# Altium project mchf_pro_mix.PrjPCB
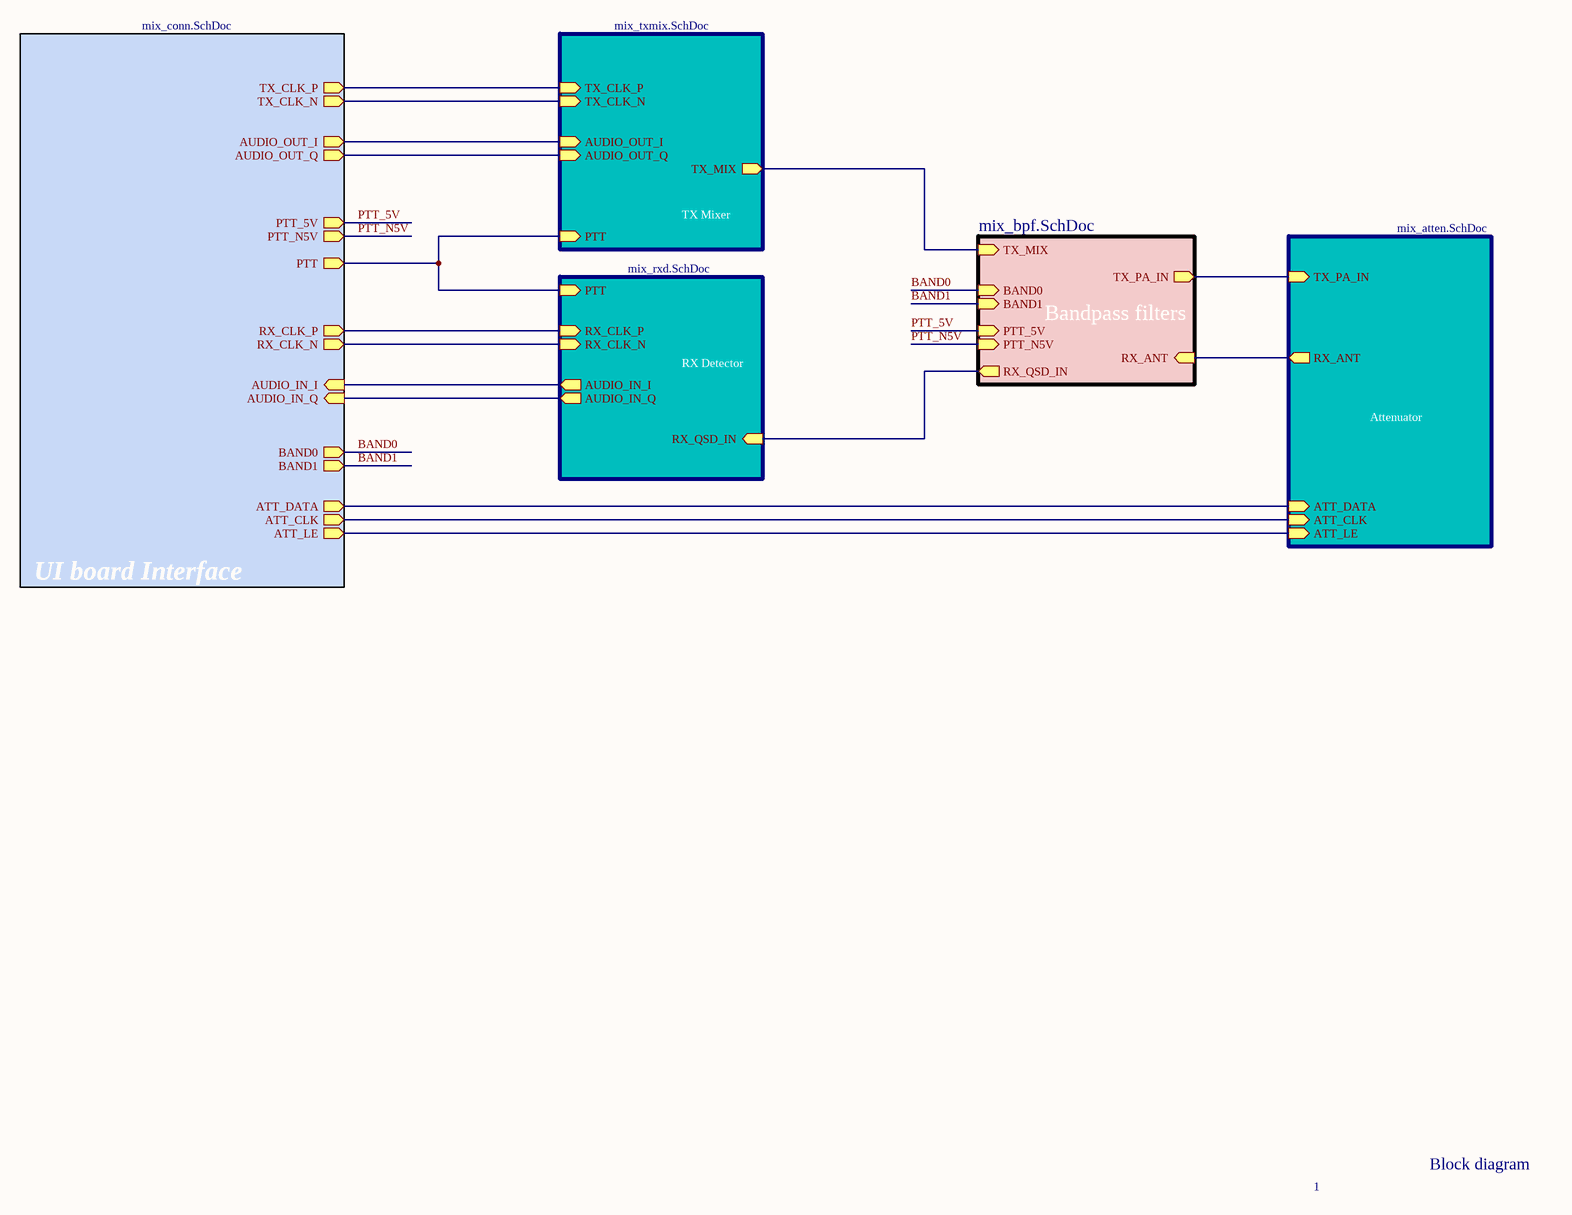
[diagram p0: mix_main.SchDoc]
5 sheets, 116 parts. Net scope: hierarchical (ports join the sheet entries above them; power ports are global).
Board file: mchf_pro_mix.PcbDoc
Sheets:
  mix_main.SchDoc
    UI board Interface = mix_conn.SchDoc
    TX Mixer = mix_txmix.SchDoc
    RX Detector = mix_rxd.SchDoc
    Attenuator = mix_atten.SchDoc

## Sheet mix_main.SchDoc: mcHF Pro Transceiver Mixer board
size A3; Author: Krassi Atanassov; CompanyName: MØNKA; Engineer: For radio amateurs experimentation, non-commercial use only. Thank you!; Revision: 0.8.6; SheetTotal: 6

### Sub-sheets
Attenuator = mix_atten.SchDoc: RX_ANT (out), ATT_DATA (in), ATT_CLK (in), ATT_LE (in), TX_PA_IN (in)
Bandpass filters = mix_bpf.SchDoc (file not in this document): BAND0 (in), BAND1 (in), PTT_5V (in), RX_ANT (in), TX_PA_IN (out), PTT_N5V (in), RX_QSD_IN (out), TX_MIX (in)
RX Detector = mix_rxd.SchDoc: RX_QSD_IN (in), AUDIO_IN_I (out), AUDIO_IN_Q (out), PTT (in), RX_CLK_N (in), RX_CLK_P (in)
TX Mixer = mix_txmix.SchDoc: TX_MIX (out), TX_CLK_P (in), TX_CLK_N (in), AUDIO_OUT_I (in), AUDIO_OUT_Q (in), PTT (in)
UI board Interface = mix_conn.SchDoc: AUDIO_OUT_Q (out), AUDIO_IN_I (in), AUDIO_OUT_I (out), AUDIO_IN_Q (in), RX_CLK_N (out), RX_CLK_P (out), TX_CLK_P (out), TX_CLK_N (out), PTT (out), ATT_DATA (out), ATT_CLK (out), ATT_LE (out), PTT_5V (out), PTT_N5V (out), BAND0 (out), BAND1 (out)

### Nets
ATT_CLK: sheet UI board Interface/ATT_CLK, sheet Attenuator/ATT_CLK
ATT_DATA: sheet UI board Interface/ATT_DATA, sheet Attenuator/ATT_DATA
ATT_LE: sheet UI board Interface/ATT_LE, sheet Attenuator/ATT_LE
BAND0: sheet UI board Interface/BAND0, sheet Bandpass filters/BAND0
BAND1: sheet UI board Interface/BAND1, sheet Bandpass filters/BAND1
PTT_3V: sheet UI board Interface/PTT, sheet TX Mixer/PTT, sheet RX Detector/PTT
PTT_5V: sheet UI board Interface/PTT_5V, sheet Bandpass filters/PTT_5V
PTT_N5V: sheet UI board Interface/PTT_N5V, sheet Bandpass filters/PTT_N5V
NetC30a_1: sheet RX Detector/RX_QSD_IN, sheet Bandpass filters/RX_QSD_IN
NetC73_1: sheet TX Mixer/TX_MIX, sheet Bandpass filters/TX_MIX
NetC82_1: sheet Bandpass filters/RX_ANT, sheet Attenuator/RX_ANT
NetC85_2: sheet Bandpass filters/TX_PA_IN, sheet Attenuator/TX_PA_IN
NetJ2MIX_A2: sheet UI board Interface/AUDIO_IN_I, sheet RX Detector/AUDIO_IN_I
NetJ2MIX_A3: sheet UI board Interface/AUDIO_IN_Q, sheet RX Detector/AUDIO_IN_Q
NetJ2MIX_A4: sheet UI board Interface/AUDIO_OUT_I, sheet TX Mixer/AUDIO_OUT_I
NetJ2MIX_A5: sheet UI board Interface/AUDIO_OUT_Q, sheet TX Mixer/AUDIO_OUT_Q
NetJ2MIX_A15: sheet UI board Interface/RX_CLK_N, sheet RX Detector/RX_CLK_N
NetJ2MIX_A16: sheet UI board Interface/RX_CLK_P, sheet RX Detector/RX_CLK_P
NetJ2MIX_A17: sheet UI board Interface/TX_CLK_P, sheet TX Mixer/TX_CLK_P
NetJ2MIX_A18: sheet UI board Interface/TX_CLK_N, sheet TX Mixer/TX_CLK_N

### Notes on the sheet
- 1
- Block diagram
- Date:
- File:
- Revision:
- Sheet
- of
- License:

## Sheet mix_conn.SchDoc: mcHF Pro Transceiver Mixer board
size A3; Author: Krassi Atanassov; CompanyName: MØNKA; Engineer: For radio amateurs experimentation, non-commercial use only. Thank you!; Revision: 0.8.6; SheetTotal: 6
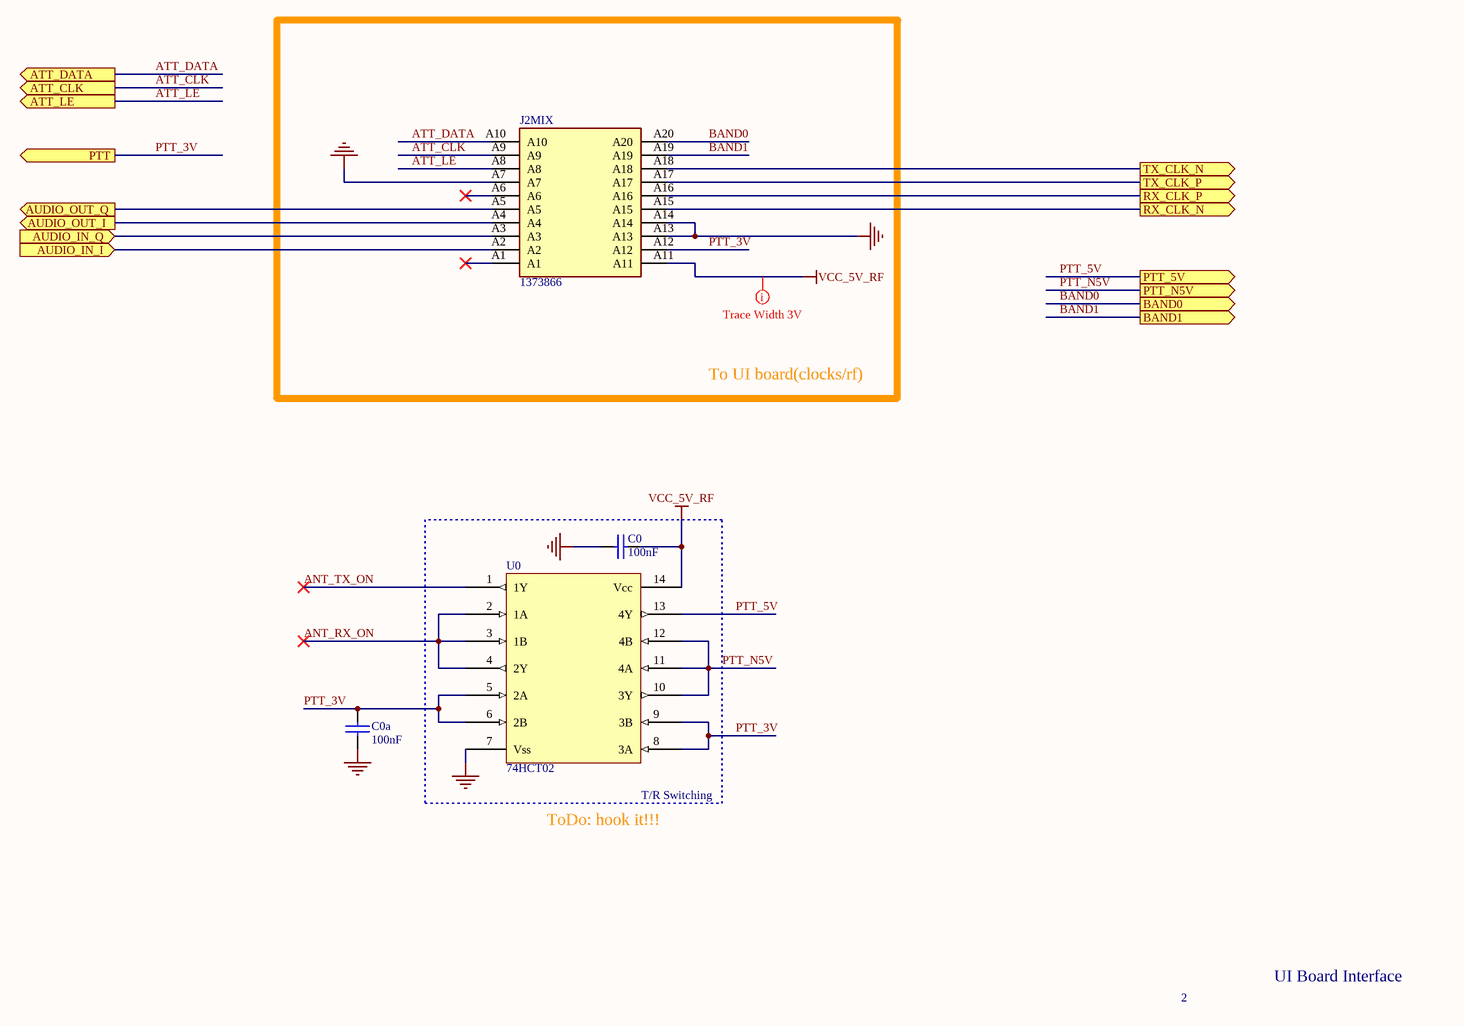
[diagram p1: mix_conn.SchDoc]

### Parts
C0  100nF  [0805]
C0a  100nF  [0805]
J2MIX  1373866  [YuanQi4mm]
U0  74HCT02  [SO-14]

### Blocks framed on the sheet
To UI board(clocks/rf): J2MIX
T/R Switching: C0 U0

### Ports
ATT_CLK (out), ATT_DATA (out), ATT_LE (out), AUDIO_IN_I (in), AUDIO_IN_Q (in), AUDIO_OUT_I (out), AUDIO_OUT_Q (out), BAND0 (out), BAND1 (out), PTT (out), PTT_5V (out), PTT_N5V (out), RX_CLK_N (out), RX_CLK_P (out), TX_CLK_N (out), TX_CLK_P (out)

### Nets
GND: C0.2 C0a.2 J2MIX.A7 J2MIX.A13 J2MIX.A14 U0.7(Vss)
VCC_5V_RF: C0.1 J2MIX.A11 U0.14(Vcc)
ANT_RX_ON: U0.2(1A) U0.3(1B) U0.4(2Y)
ANT_TX_ON: U0.1(1Y)
ATT_CLK: J2MIX.A9 ; port ATT_CLK
ATT_DATA: J2MIX.A10 ; port ATT_DATA
ATT_LE: J2MIX.A8 ; port ATT_LE
BAND0: J2MIX.A20 ; port BAND0
BAND1: J2MIX.A19 ; port BAND1
PTT_3V: C0a.1 J2MIX.A12 U0.5(2A) U0.6(2B) U0.8(3A) U0.9(3B) ; port PTT
PTT_5V: U0.13(4Y) ; port PTT_5V
PTT_N5V: U0.10(3Y) U0.11(4A) U0.12(4B) ; port PTT_N5V
NetJ2MIX_A2: J2MIX.A2 ; port AUDIO_IN_I
NetJ2MIX_A3: J2MIX.A3 ; port AUDIO_IN_Q
NetJ2MIX_A4: J2MIX.A4 ; port AUDIO_OUT_I
NetJ2MIX_A5: J2MIX.A5 ; port AUDIO_OUT_Q
NetJ2MIX_A15: J2MIX.A15 ; port RX_CLK_N
NetJ2MIX_A16: J2MIX.A16 ; port RX_CLK_P
NetJ2MIX_A17: J2MIX.A17 ; port TX_CLK_P
NetJ2MIX_A18: J2MIX.A18 ; port TX_CLK_N

Not connected (* = marked no-connect by the designer): J2MIX A1* A6*

### Layout directives
rule Width Constraint [Pref Width = 12mil    Min Width = 12mil    Max Width = 12mil]: VCC_5V_RF

### Notes on the sheet
- ToDo: hook it!!!
- 2
- UI Board Interface
- Date:
- File:
- Revision:
- Sheet
- of
- License:

### Library data of the parts
C0 C0a = CAP: Capacitor; QT Order: QCC-00154; Price: 0.068
J2MIX = YQ_20p: SMD male connector, nominal current: 2.2 A, Test voltage: 840 VAC, number of positions: 20, pitch: 1.27 mm, color: black, contact surface: Gold, type of contact: Male connector, mounting: SMD soldering; Manufacturer_Name: Phoenix Contact; Geometry.Height: 6.75mm; Mouser Part Number: 651-1373866; Mouser Price/Stock: https://www.mouser.co.uk/ProductDetail/Phoenix-Contact/1373866?qs=2SLPxufLcgAs0enIXKjUUw%3D%3D; Manufacturer_Part_Number: 1373866; Datasheet Link: http://www.phoenixcontact.com/gb/produkte/1373866
U0 = 74HCT02: Quad 2-input NOR gate; QT Order: QCI-01079; Price: 0.38

## Sheet mix_txmix.SchDoc: mcHF Pro Transceiver Mixer board
size A3; Author: Krassi Atanassov; CompanyName: MØNKA; Engineer: For radio amateurs experimentation, non-commercial use only. Thank you!; Revision: 0.8.6; SheetTotal: 6
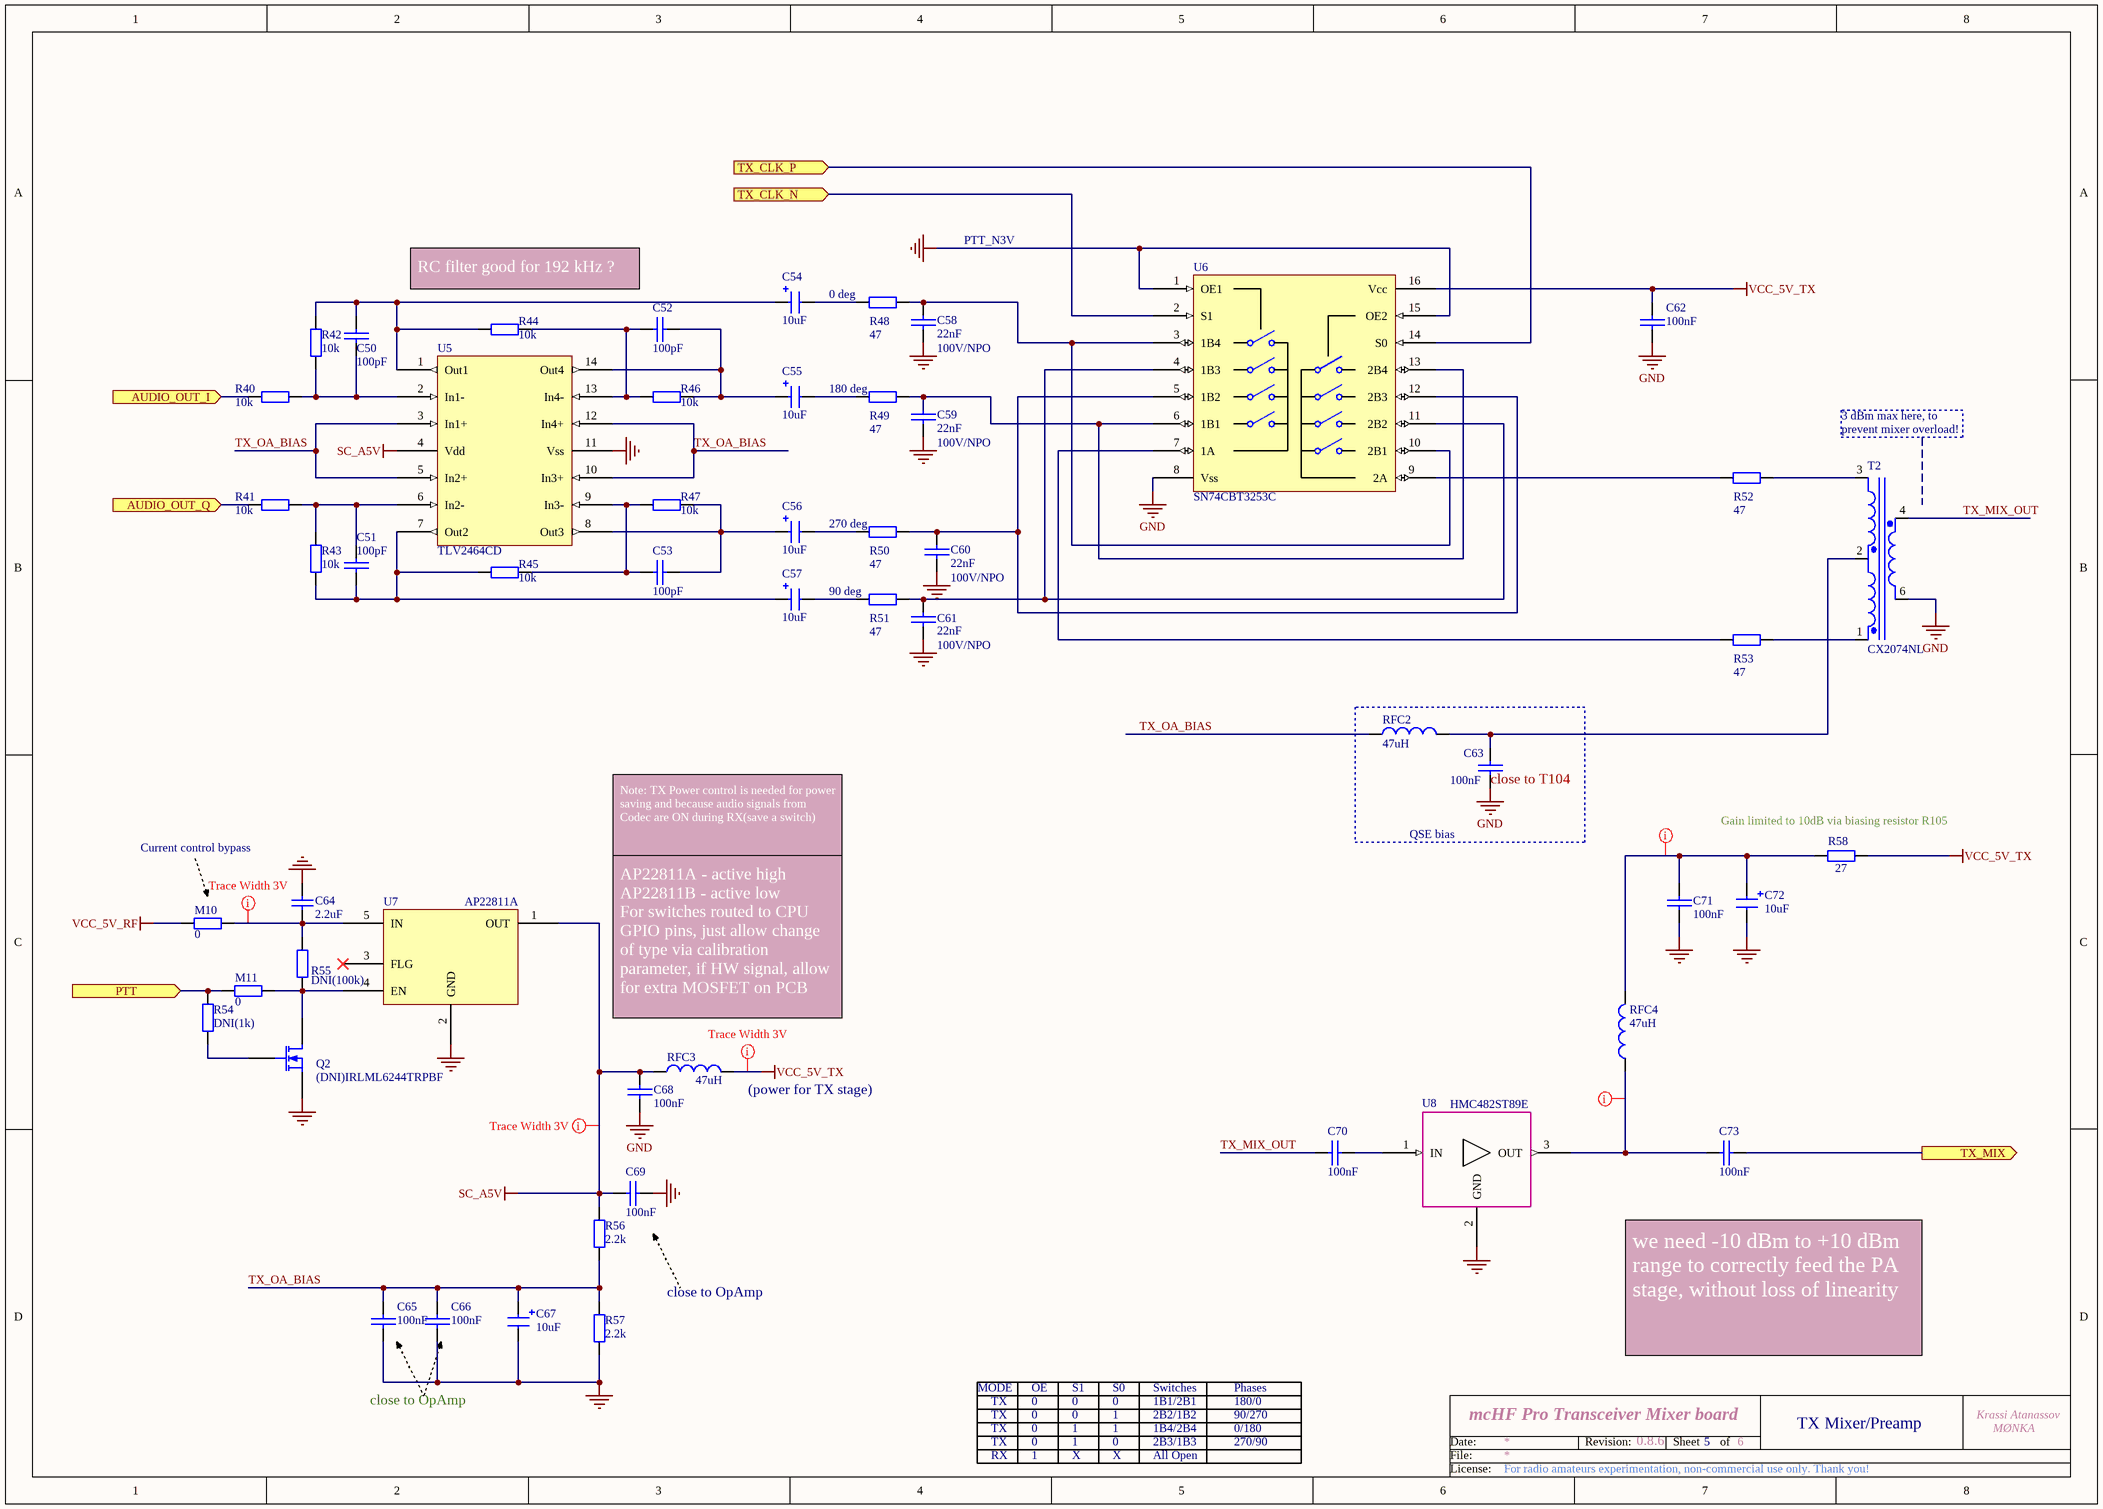
[diagram p2: mix_txmix.SchDoc]

### Parts
C50  100pF  [0805]
C51  100pF  [0805]
C52  100pF  [0805]
C53  100pF  [0805]
C54  10uF  [1206_Elec_Cap]
C55  10uF  [1206_Elec_Cap]
C56  10uF  [1206_Elec_Cap]
C57  10uF  [1206_Elec_Cap]
C58  22nF  Voltage: 100V/NPO  [CAP_B]
C59  22nF  Voltage: 100V/NPO  [CAP_B]
C60  22nF  Voltage: 100V/NPO  [CAP_B]
C61  22nF  Voltage: 100V/NPO  [CAP_B]
C62  100nF  [0805]
C63  100nF  [0805]
C64  2.2uF  [0805]
C65  100nF  [0805]
C66  100nF  [0805]
C67  10uF  [1206_Elec_Cap]
C68  100nF  [0805]
C69  100nF  [0805]
C70  100nF  [0805]
C71  100nF  [0805]
C72  10uF  [1206_Elec_Cap]
C73  100nF  [0805]
M10  0  [0805]
M11  0  [0805]
Q2  (DNI)IRLML6244TRPBF  [SOT-23]  (no BOM)
R40  10k  [0805]
R41  10k  [0805]
R42  10k  [0805]
R43  10k  [0805]
R44  10k  [0805]
R45  10k  [0805]
R46  10k  [0805]
R47  10k  [0805]
R48  47  [0805]
R49  47  [0805]
R50  47  [0805]
R51  47  [0805]
R52  47  [0805]
R53  47  [0805]
R54  DNI(1k)  [0805]  (no BOM)
R55  DNI(100k)  [0805]  (no BOM)
R56  2.2k  [0805]
R57  2.2k  [0805]
R58  27  [1206]
RFC2  47uH  [0805]
RFC3  47uH  [0805]
RFC4  47uH  [0805]
T2  CX2074NL  [SOP5_NEW1]
U5  TLV2464CD  [SO-14-Pro]
U6  SN74CBT3253C  [SO-16-Pro]
U7  AP22811A  [SOT25-5]
U8  HMC482ST89E  [SOT89L_new]

### Blocks framed on the sheet
close to T104: C63 RFC2

### Ports
AUDIO_OUT_I (in), AUDIO_OUT_Q (in), PTT (in), TX_CLK_N (in), TX_CLK_P (in), TX_MIX (out)

### Nets
GND: C58.2 C59.2 C60.2 C61.2 C62.1 C63.1 C64.1 C65.1 C66.1 C67.2 C68.1 C69.1 C71.2 C72.2 Q2.2(S) R57.1 T2.6(Pri+) U5.11(Vss) U6.1(OE1) U6.8(Vss) U6.15(OE2) U7.2(GND) U8.2(GND)
SC_A5V: C68.2 C69.2 R56.2 RFC3.1 U5.4(Vdd) U7.1(OUT)
VCC_5V_RF: M10.1
VCC_5V_TX: C62.2 R58.1 RFC3.2 U6.16(Vcc)
PTT_3V: M11.2 R54.2 ; port PTT
TX_MIX_OUT: C70.2 T2.4(Pri-)
TX_OA_BIAS: C65.2 C66.2 C67.1 R56.1 R57.2 RFC2.1 U5.3(In1+) U5.5(In2+) U5.10(In3+) U5.12(In4+)
NetC50_1: C50.1 R40.2 R42.1 U5.2(In1-)
NetC50_2: C50.2 C54.1 R42.2 R44.1 U5.1(Out1)
NetC51_1: C51.1 C57.1 R43.1 R45.1 U5.7(Out2)
NetC51_2: C51.2 R41.2 R43.2 U5.6(In2-)
NetC52_1: C52.1 C55.1 R46.2 U5.14(Out4)
NetC52_2: C52.2 R44.2 R46.1 U5.13(In4-)
NetC53_1: C53.1 C56.1 R47.2 U5.8(Out3)
NetC53_2: C53.2 R45.2 R47.1 U5.9(In3-)
NetC54_2: C54.2 R48.1
NetC55_2: C55.2 R49.1
NetC56_2: C56.2 R50.1
NetC57_2: C57.2 R51.1
NetC58_1: C58.1 R48.2 U6.3(1B4) U6.10(2B1)
NetC59_1: C59.1 R49.2 U6.6(1B1) U6.13(2B4)
NetC60_1: C60.1 R50.2 U6.5(1B2) U6.12(2B3)
NetC61_1: C61.1 R51.2 U6.4(1B3) U6.11(2B2)
NetC63_2: C63.2 RFC2.2 T2.2(SecCmn)
NetC64_2: C64.2 M10.2 R55.1 U7.5(IN)
NetC70_1: C70.1 U8.1(IN)
NetC71_1: C71.1 C72.1 R58.2 RFC4.2
NetC73_1: C73.1 ; port TX_MIX
NetC73_2: C73.2 RFC4.1 U8.3(OUT)
NetJ2MIX_A4: R40.1 ; port AUDIO_OUT_I
NetJ2MIX_A5: R41.1 ; port AUDIO_OUT_Q
NetJ2MIX_A17: U6.14(S0) ; port TX_CLK_P
NetJ2MIX_A18: U6.2(S1) ; port TX_CLK_N
NetM11_1: M11.1 Q2.3(D) R55.2 U7.4(EN)
NetQ2_1: Q2.1(G) R54.1
NetR52_1: R52.1 U6.9(2A)
NetR52_2: R52.2 T2.3(Sec180)
NetR53_1: R53.1 U6.7(1A)
NetR53_2: R53.2 T2.1(Sec0)

Not connected (* = marked no-connect by the designer): U7 3(FLG)*

### Layout directives
rule Width Constraint [Pref Width = 12mil    Min Width = 12mil    Max Width = 12mil]: NetC64_2, NetC71_1, NetC73_2, SC_A5V, VCC_5V_TX

### Notes on the sheet
- PTT_N3V
- RC filter good for 192 kHz ?
- (near R48) 0 deg
- (near R49) 180 deg
- 3 dBm max here, to
- (near T2) prevent mixer overload!
- (near R50) 270 deg
- (near R51) 90 deg
- Current control bypass
- Note: TX Power control is needed for power saving and because audio signals from Codec are ON during RX(save a switch)
- QSE bias
- (near R58) Gain limited to 10dB via biasing resistor R105
- AP22811A - active high                                 AP22811B - active low                             For switches routed to CPU GPIO pins, just allow change of type via calibration parameter, if HW signal, allow for extra MOSFET on PCB
- (near RFC3) (power for TX stage)
- close to OpAmp
- MODE
- OE
- S1
- S0
- Switches
- Phases
- we need -10 dBm to +10 dBm range to correctly feed the PA stage, without loss of linearity
- TX
- RX
- 0
- 1
- X
- 1B1/2B1
- 2B2/1B2
- 2B3/1B3
- 1B4/2B4
- All Open
- 180/0
- 90/270
- 270/90
- 0/180
- 5
- TX Mixer/Preamp
- Date:
- File:
- Revision:
- Sheet
- of
- License:

### Library data of the parts
C50-C53 = CAP: Capacitor; Order: FN 233-2692; QT Order: QCC-00070; Price: 0.056
C54-C57 C67 C72 = CAP-POL: Electrolitic capacitor; Order: FN 233-3009; QT Order: QCC-00166; Price: 0.204
C58-C61 = CAP: Capacitor; Order: FN 221-1120; Price: 0.84
C62 C63 C65 C66 C68-C71 C73 = CAP: Capacitor; Order: FN 252-2090; QT Order: QCC-00154; Price: 0.068
C64 = CAP SMD 0603  X5R 1礔 25V 10%: 0603  X5R 1礔; Rated voltage: 25V; Tolerance: 10%; Manufacturer: *; Manufacturer P/N: *; Order code Farnell: 1288202RL; Value: 1礔; Power: *; Technology: X5R; Temperature  Factor: *; Temperature Max: +125癈; Temperature Min: -55癈; STS Code: *
M10 M11 R54 = RES: Resistor; Order: FN 933-3681; QT Order: QCR-00268; Price: 0.009
Q2 = MOSFET-N: N-Channel MOSFET; QT Order: QCT-00022; QT Price: 0.28; Order: FN 186-4517; Price: 0.231
R40-R47 = RES: Resistor; Order: FN 146-9856; QT Order: QCR-00349; Price: 0.021
R48-R53 = RES: Resistor; Order: FN 173-8942; QT Order: QCR-00293; Price: 0.052
R55 = RES: Resistor; Order: FN 157-6459; QT Order: QCR-00579; Price: 0.061
R56 R57 = RES: Resistor; Order: FN 188-7289; QT Order: QCR-00333; Price: 0.046
R58 = RES: Resistor; Order: FN 205-7802; QT Order: QCR-00427; Price: 0.017
RFC2-RFC4 = TDK-NLV25T: INDUCTOR, SIGNAL LINE, 4.7UH, 1005; Order: FN 166-9895; Price: 0.166
T2 = CX2074NL: Wideband RF Transformer 1:4; Order: DK 553-1655-ND; Price: 2.01
U5 = TLV2464CD: Low Power, Rail-To-Rail OpAmp; Order: FN 845-5171; Price: 1.47
U6 = SN74CBT3253C: Dual 4:1 Demux/Analog Switch; Order: FN 175-0447; Price: 0.69
U7 = AP22811: High-side switch; Order: FN 274-8550
U8 = HMS482ST89E: MMIC AMPLIFIER; Order: FN 245-6527; Notes: What was the Farnell replacement part for this ? Or source from Ali, as it is EOL; Price: 2.82

## Sheet mix_rxd.SchDoc: mcHF Pro Transceiver Mixer board
size A3; Author: Krassi Atanassov; CompanyName: MØNKA; Engineer: For radio amateurs experimentation, non-commercial use only. Thank you!; Revision: 0.8.6; SheetTotal: 6
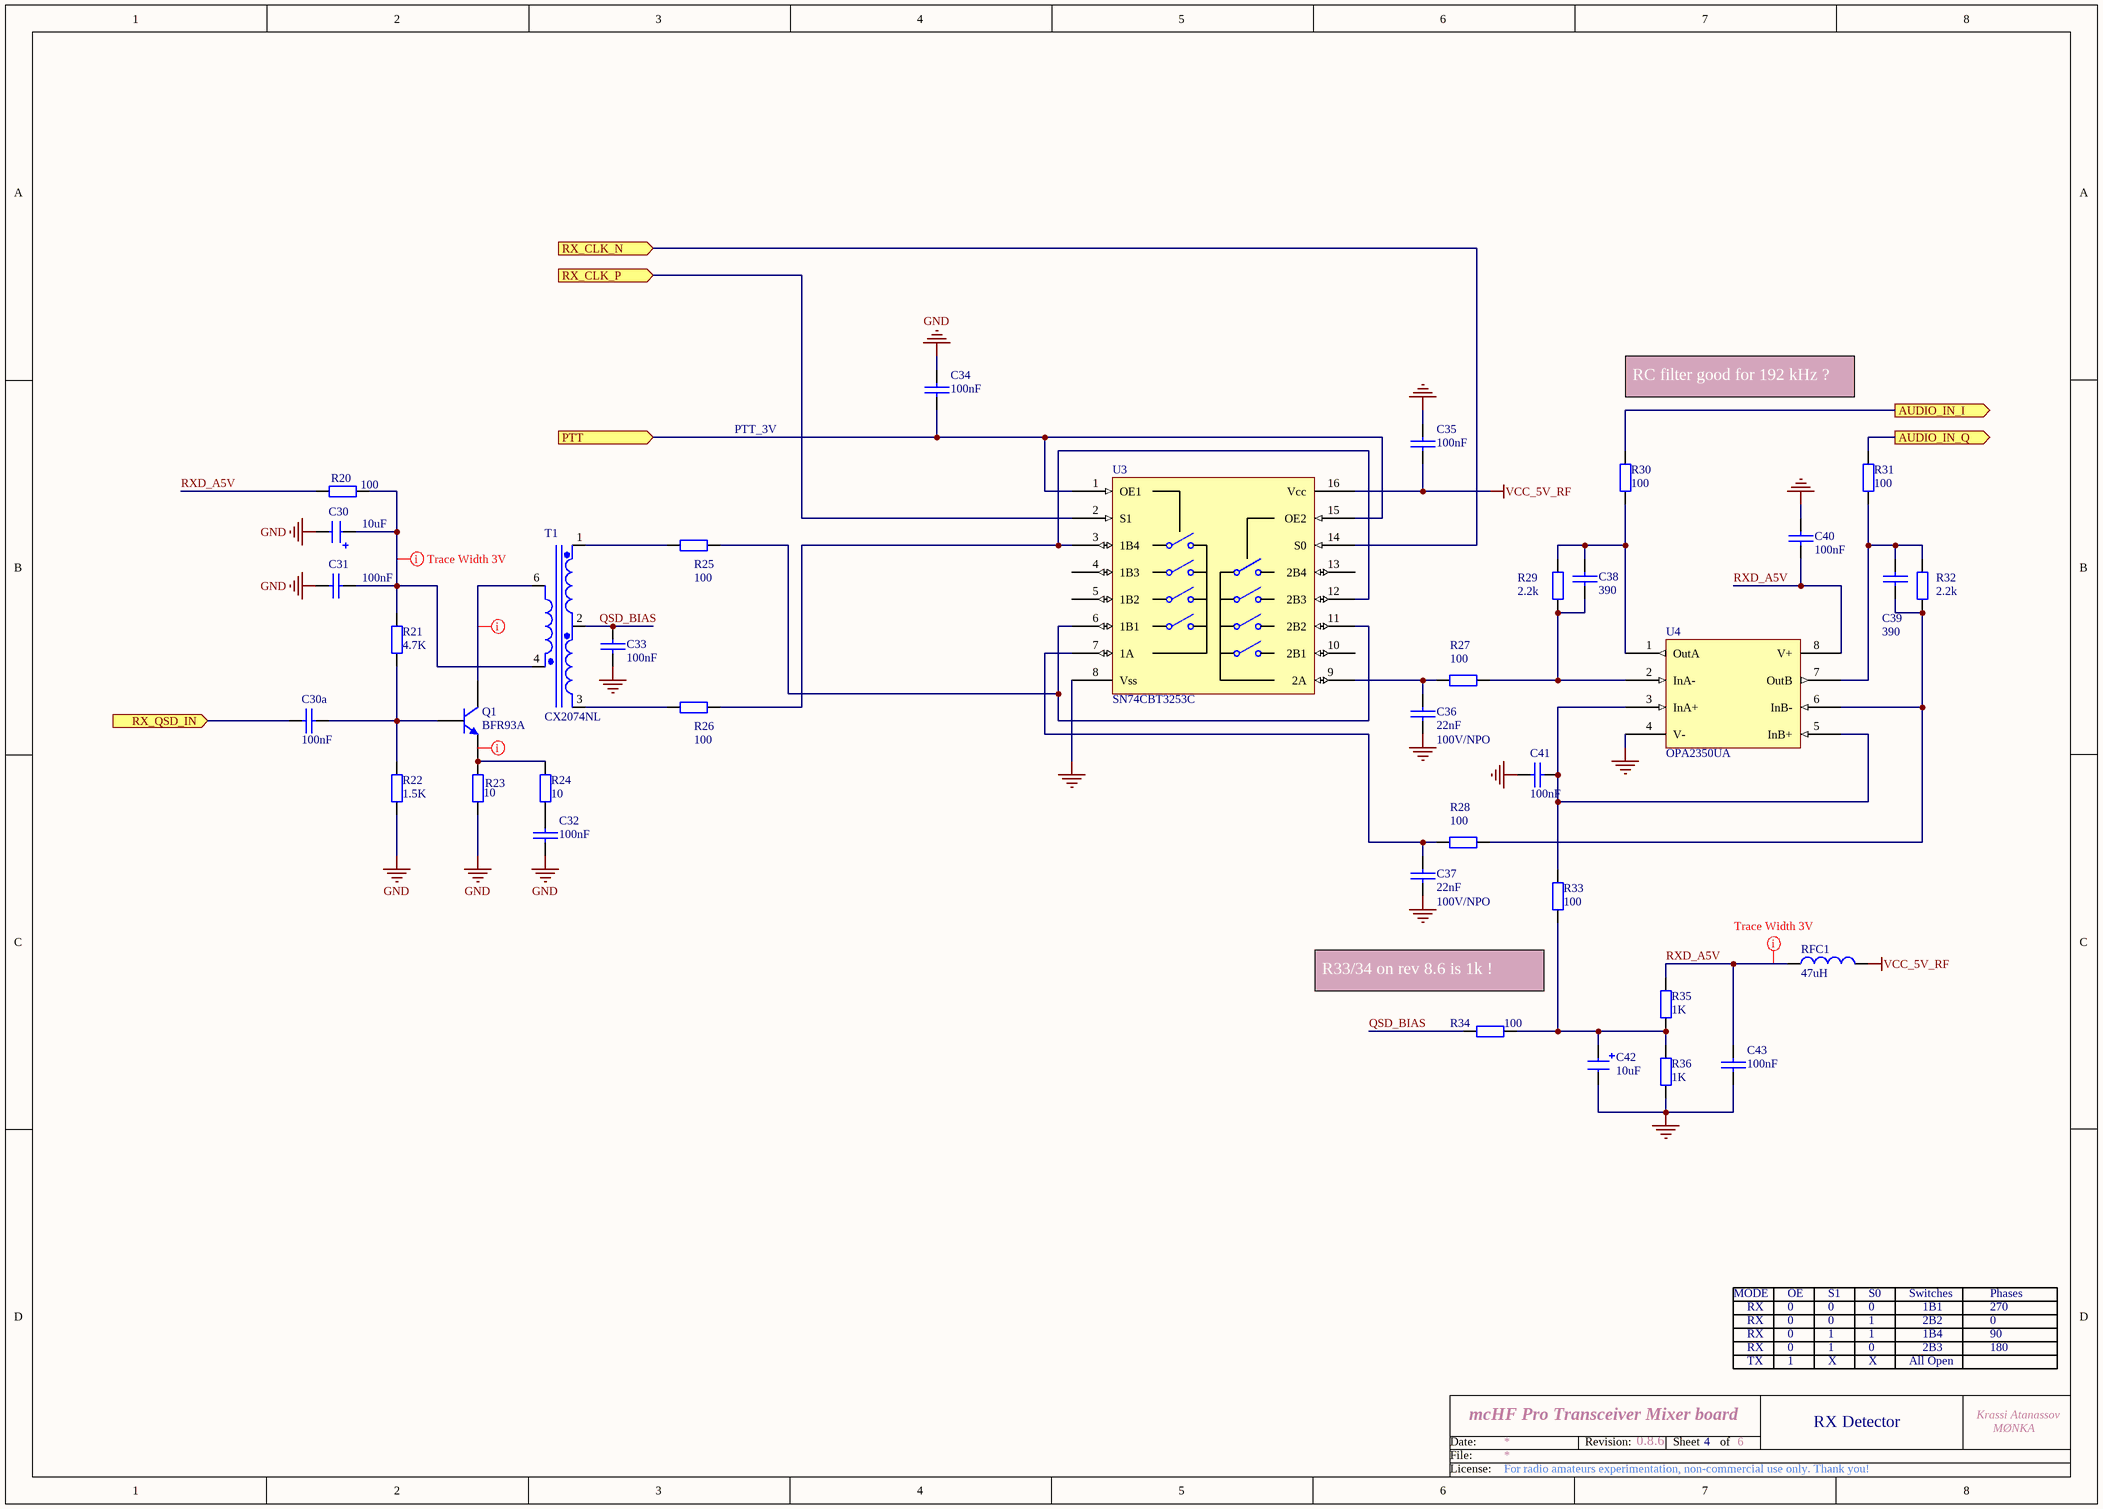
[diagram p3: mix_rxd.SchDoc]

### Parts
C30  10uF  [1206_Elec_Cap]
C30a  100nF  [0805]
C31  100nF  [0805]
C32  100nF  [0805]
C33  100nF  [0805]
C34  100nF  [0805]
C35  100nF  [0805]
C36  22nF  Voltage: 100V/NPO  [CAP_B]
C37  22nF  Voltage: 100V/NPO  [CAP_B]
C38  390  [0805]
C39  390  [0805]
C40  100nF  [0805]
C41  100nF  [0805]
C42  10uF  [1206_Elec_Cap]
C43  100nF  [0805]
Q1  BFR93A  [SOT-23]
R20  100  [0805]
R21  4.7K  [0805]
R22  1.5K  [0805]
R23  10  [0805]
R24  10  [0805]
R25  100  [0805]
R26  100  [0805]
R27  100  [0805]
R28  100  [0805]
R29  2.2k  [0805]
R30  100  [0805]
R31  100  [0805]
R32  2.2k  [0805]
R33  100  [0805]
R34  100  [0805]
R35  1K  [0805]
R36  1K  [0805]
RFC1  47uH  [0805]
T1  CX2074NL  [SOP5_NEW1]
U3  SN74CBT3253C  [SO-16-Pro]
U4  OPA2350UA  [SO-8]

### Ports
AUDIO_IN_I (out), AUDIO_IN_Q (out), PTT (in), RX_CLK_N (in), RX_CLK_P (in), RX_QSD_IN (in)

### Nets
GND: C30.2 C31.2 C32.1 C33.2 C34.2 C35.2 C36.2 C37.2 C40.1 C41.2 C42.2 C43.1 R22.2 R23.1 R36.1 U3.8(Vss) U4.4(V-)
VCC_5V_RF: C35.1 RFC1.2 U3.16(Vcc)
PTT_3V: C34.1 U3.1(OE1) U3.15(OE2) ; port PTT
QSD_BIAS: C33.1 R34.2 T1.2(SecCmn)
RXD_A5V: C40.2 C43.2 R20.1 R35.2 RFC1.1 U4.8(V+)
NetC30_1: C30.1 C31.1 R20.2 R21.1 T1.4(Pri-)
NetC30a_1: C30a.1 ; port RX_QSD_IN
NetC30a_2: C30a.2 Q1.1(B) R21.2 R22.1
NetC32_2: C32.2 R24.1
NetC36_1: C36.1 R27.1 U3.9(2A)
NetC37_1: C37.1 R28.1 U3.7(1A)
NetC38_1: C38.1 R27.2 R29.1 U4.2(InA-)
NetC38_2: C38.2 R29.2 R30.1 U4.1(OutA)
NetC39_1: C39.1 R28.2 R32.1 U4.6(InB-)
NetC39_2: C39.2 R31.1 R32.2 U4.7(OutB)
NetC41_1: C41.1 R33.2 U4.3(InA+) U4.5(InB+)
NetC42_1: C42.1 R33.1 R34.1 R35.1 R36.2
NetJ2MIX_A2: R30.2 ; port AUDIO_IN_I
NetJ2MIX_A3: R31.2 ; port AUDIO_IN_Q
NetJ2MIX_A15: U3.14(S0) ; port RX_CLK_N
NetJ2MIX_A16: U3.2(S1) ; port RX_CLK_P
NetQ1_2: Q1.2(E) R23.2 R24.2
NetQ1_3: Q1.3(C) T1.6(Pri+)
NetR25_1: R25.1 T1.1(Sec0)
NetR25_2: R25.2 U3.6(1B1) U3.11(2B2)
NetR26_1: R26.1 T1.3(Sec180)
NetR26_2: R26.2 U3.3(1B4) U3.12(2B3)

Not connected (* = marked no-connect by the designer): U3 4(1B3) 5(1B2) 10(2B1) 13(2B4)

### Layout directives
rule Width Constraint [Pref Width = 12mil    Min Width = 12mil    Max Width = 12mil]: (no net found under the mark), NetC30_1, NetQ1_3, RXD_A5V

### Notes on the sheet
- PTT_3V
- RC filter good for 192 kHz ?
- R33/34 on rev 8.6 is 1k !
- MODE
- RX
- 0
- OE
- S1
- S0
- 1
- Switches
- 1B1
- 2B2
- Phases
- 270
- TX
- X
- All Open
- 2B3
- 1B4
- 180
- 90
- 4
- RX Detector
- Date:
- File:
- Revision:
- Sheet
- of
- License:

### Library data of the parts
C30 C42 = CAP-POL: as C54 on sheet mix_txmix; Price: 0.204
C30a C31-C35 C40 C41 C43 = CAP: as C62 on sheet mix_txmix; Price: 0.068
C36 C37 = CAP: Capacitor; Order: FN 221-1120; Price: 0.84
C38 C39 = CAP: Capacitor; Order: FN 233-2701; QT Order: QCC-00125; Price: 0.078
Q1 = BFR93A: TRANSISTOR, RF, NPN, 12V, 0.035MA,SOT-23; Order: FN 108-1300; Price: 0.161
R20 R25-R28 R30 R31 R33 R34 = RES: Resistor; Order: FN 933-2375; QT Order: QCR-00301; Price: 0.027
R21 = RES: Resistor; Order: FN 200-8383; QT Order: QCR-00341; Price: 0.024
R22 = RES: Resistor; Order: FN 165-2940; QT Order: QCR-00329; Price: 0.036
R23 R24 = RES: Resistor; Order: FN 933-2421; QT Order: QCR-00279; Price: 0.013
R29 R32 = RES: as R56 on sheet mix_txmix; Price: 0.046
R35 R36 = RES: as R55 on sheet mix_txmix; Price: 0.061
RFC1 = TDK-NLV25T: as RFC2 on sheet mix_txmix; Price: 0.166
T1 = CX2074NL: as T2 on sheet mix_txmix; Price: 2.01
U3 = SN74CBT3253C: as U6 on sheet mix_txmix; Price: 0.69
U4 = OPA2350UA: High Speed, Single Supply OpAmp; Order: FN 110-1542; Price: 4.67

## Sheet mix_atten.SchDoc: mcHF Pro Transceiver Mixer board
size A3; Author: Krassi Atanassov; CompanyName: MØNKA; Engineer: For radio amateurs experimentation, non-commercial use only. Thank you!; Revision: 0.8.6; SheetTotal: 6
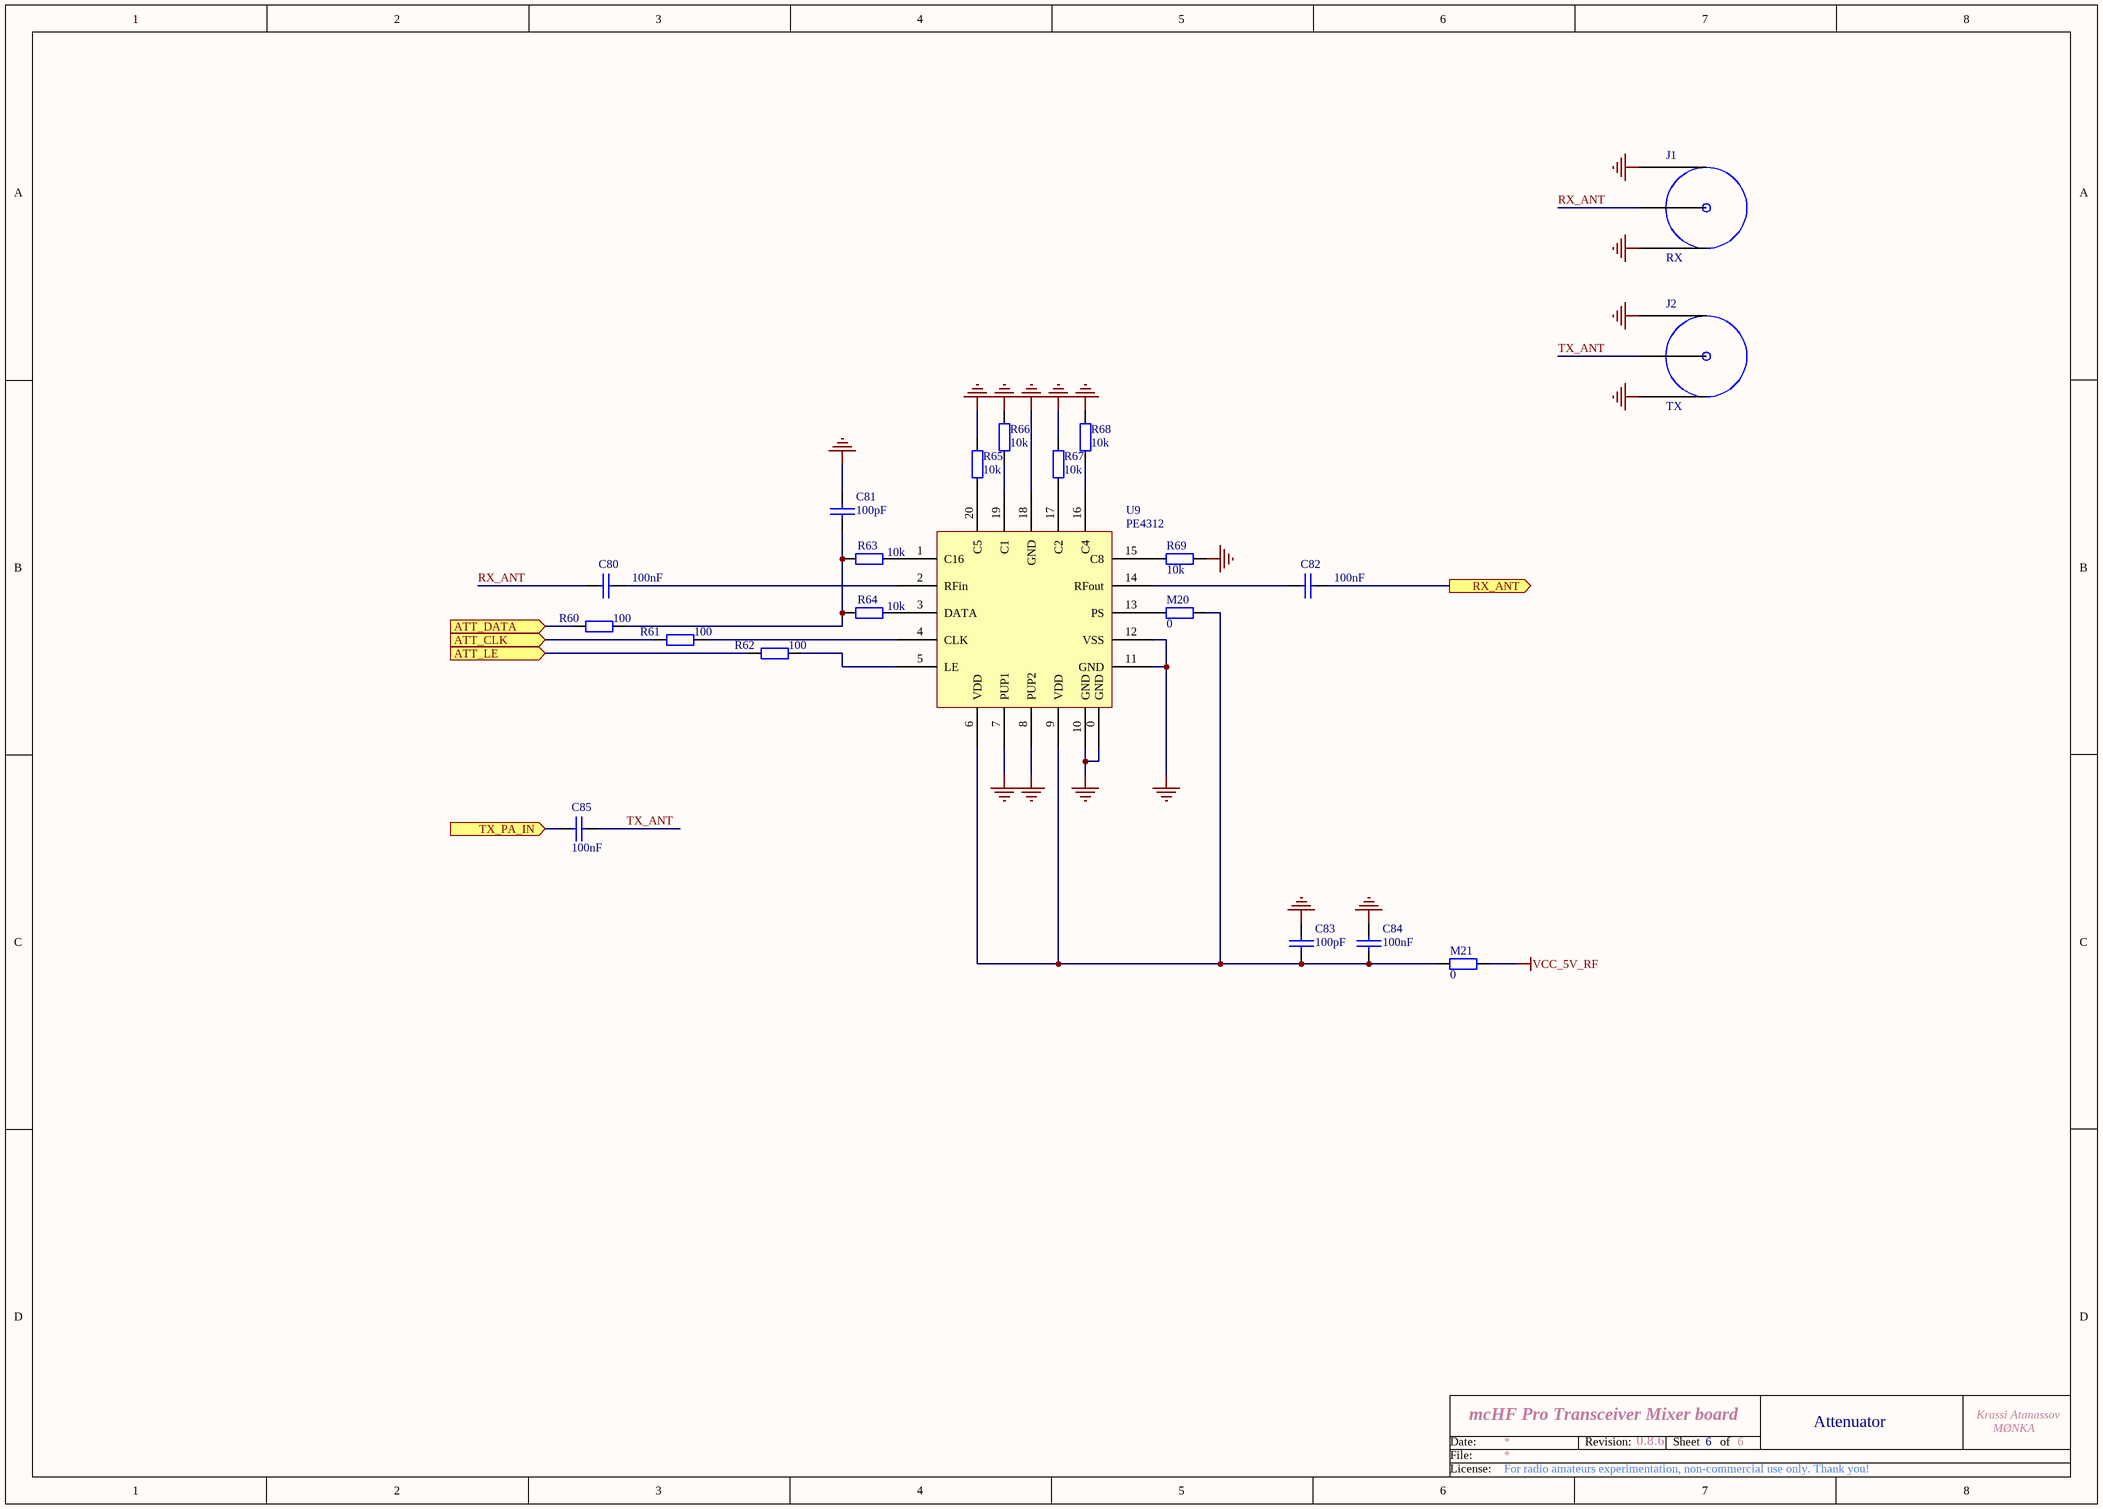
[diagram p4: mix_atten.SchDoc]

### Parts
C80  100nF  [0805]
C81  100pF  [0805]
C82  100nF  [0805]
C83  100pF  [0805]
C84  100nF  [0805]
C85  100nF  [0805]
J1  RX  [ufl]
J2  TX  [ufl]
M20  0  [0805]
M21  0  [0805]
R60  100  [0805]
R61  100  [0805]
R62  100  [0805]
R63  10k  [0805]
R64  10k  [0805]
R65  10k  [0805]
R66  10k  [0805]
R67  10k  [0805]
R68  10k  [0805]
R69  10k  [0805]
U9  PE4312  [QFN20_4X4]

### Ports
ATT_CLK (in), ATT_DATA (in), ATT_LE (in), RX_ANT (out), TX_PA_IN (in)

### Nets
GND: C81.2 C83.2 C84.2 J1.1 J1.3 J2.1 J2.3 R65.2 R66.2 R67.2 R68.2 R69.1 U9.0(GND) U9.7(PUP1) U9.8(PUP2) U9.10(GND) U9.11(GND) U9.12(VSS) U9.18(GND)
VCC_5V_RF: M21.2
ATT_CLK: R61.2 ; port ATT_CLK
ATT_DATA: R60.2 ; port ATT_DATA
ATT_LE: R62.2 ; port ATT_LE
RX_ANT: C80.2 J1.2
TX_ANT: C85.1 J2.2
NetC80_1: C80.1 U9.2(RFin)
NetC81_1: C81.1 R60.1 R63.1 R64.1
NetC82_1: C82.1 ; port RX_ANT
NetC82_2: C82.2 U9.14(RFout)
NetC83_1: C83.1 C84.1 M20.2 M21.1 U9.6(VDD) U9.9(VDD)
NetC85_2: C85.2 ; port TX_PA_IN
NetM20_1: M20.1 U9.13(PS)
NetR61_1: R61.1 U9.4(CLK)
NetR62_1: R62.1 U9.5(LE)
NetR63_2: R63.2 U9.1(C16)
NetR64_2: R64.2 U9.3(DATA)
NetR65_1: R65.1 U9.20(C5)
NetR66_1: R66.1 U9.19(C1)
NetR67_1: R67.1 U9.17(C2)
NetR68_1: R68.1 U9.16(C4)
NetR69_2: R69.2 U9.15(C8)

### Notes on the sheet
- 6
- Attenuator
- Date:
- File:
- Revision:
- Sheet
- of
- License:

### Library data of the parts
C80-C85 = CAP: as C62 on sheet mix_txmix; Price: 0.068
J1 J2 = UFL
M20 M21 = RES: as M10 on sheet mix_txmix; Price: 0.009
R60-R69 = RES: as R20 on sheet mix_rxd; Price: 0.027
U9 = PE4312: 4Ghz Attenuator

## Nets that join several sheets
GND: mix_conn (6 pins), mix_txmix (23 pins), mix_rxd (17 pins), mix_atten (19 pins)
VCC_5V_RF: mix_conn (C0.1 J2MIX.A11 U0.14), mix_txmix (M10.1), mix_rxd (C35.1 RFC1.2 U3.16), mix_atten (M21.2)
ATT_CLK: mix_conn (J2MIX.A9), mix_atten (R61.2)
ATT_DATA: mix_conn (J2MIX.A10), mix_atten (R60.2)
ATT_LE: mix_conn (J2MIX.A8), mix_atten (R62.2)
NetJ2MIX_A2: mix_conn (J2MIX.A2), mix_rxd (R30.2)
NetJ2MIX_A3: mix_conn (J2MIX.A3), mix_rxd (R31.2)
NetJ2MIX_A4: mix_conn (J2MIX.A4), mix_txmix (R40.1)
NetJ2MIX_A5: mix_conn (J2MIX.A5), mix_txmix (R41.1)
NetJ2MIX_A15: mix_conn (J2MIX.A15), mix_rxd (U3.14)
NetJ2MIX_A16: mix_conn (J2MIX.A16), mix_rxd (U3.2)
NetJ2MIX_A17: mix_conn (J2MIX.A17), mix_txmix (U6.14)
NetJ2MIX_A18: mix_conn (J2MIX.A18), mix_txmix (U6.2)
PTT_3V: mix_conn (6 pins), mix_txmix (M11.2 R54.2), mix_rxd (C34.1 U3.1 U3.15)